# Altium schematic sheet power_SUP.SchDoc
size A4
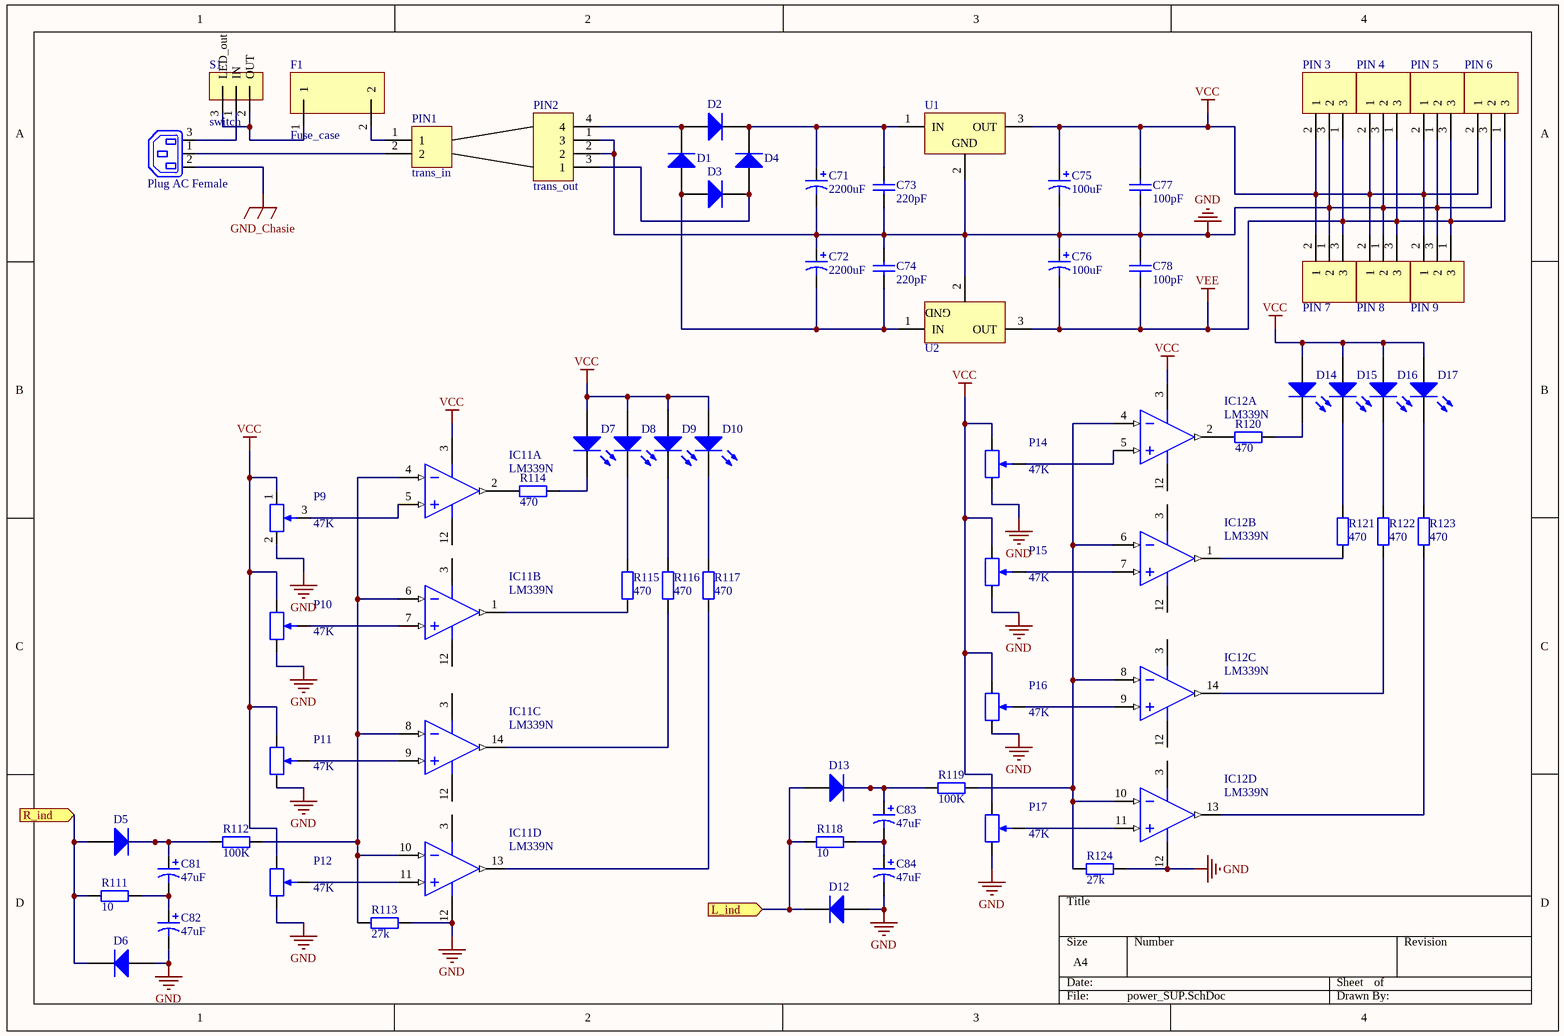
[diagram p0: power_SUP.SchDoc]

## Parts
?  Plug AC Female  [header_3]
C71  value 2200uF  [capacitor 2200uF]  (hidden comment: Cap Pol2)
C72  value 2200uF  [capacitor 2200uF]  (hidden comment: Cap Pol2)
C73  value 220pF  [220PpF]  (hidden comment: Cap)
C74  value 220pF  [220PpF]  (hidden comment: Cap)
C75  value 100uF  [Capacitor 100uF]  (hidden comment: Cap Pol2)
C76  value 100uF  [Capacitor 100uF]  (hidden comment: Cap Pol2)
C77  value 100pF  [Capacitor 100pF]  (hidden comment: Cap)
C78  value 100pF  [Capacitor 100pF]  (hidden comment: Cap)
C81  value 47uF  [Capacitor 47uF]  (hidden comment: Cap Pol2)
C82  value 47uF  [Capacitor 47uF]  (hidden comment: Cap Pol2)
C83  value 47uF  [Capacitor 47uF]  (hidden comment: Cap Pol2)
C84  value 47uF  [Capacitor 47uF]  (hidden comment: Cap Pol2)
D1  Diode 1N4007  [DO-41]  (value not drawn)
D2  Diode 1N4007  [DO-41]  (value not drawn)
D3  Diode 1N4007  [DO-41]  (value not drawn)
D4  Diode 1N4007  [DO-41]  (value not drawn)
D5  Diode 1N4007  [DO-41]  (value not drawn)
D6  Diode 1N4007  [DO-41]  (value not drawn)
D7  LED1  [LED]  (value not drawn)
D8  LED1  [LED]  (value not drawn)
D9  LED1  [LED]  (value not drawn)
D10  LED1  [LED]  (value not drawn)
D12  Diode 1N4007  [DO-41]  (value not drawn)
D13  Diode 1N4007  [DO-41]  (value not drawn)
D14  LED1  [LED]  (value not drawn)
D15  LED1  [LED]  (value not drawn)
D16  LED1  [LED]  (value not drawn)
D17  LED1  [LED]  (value not drawn)
F1  Fuse_case  [fluse_holder]
IC11  LM339N  [OPAMP_LM339]  (parts A,B,C,D of 4)
IC12  LM339N  [OPAMP_LM339]  (parts A,B,C,D of 4)
P9  value 47K  [trimmer]  (hidden comment: RPot)
P10  value 47K  [trimmer]  (hidden comment: RPot)
P11  value 47K  [trimmer]  (hidden comment: RPot)
P12  value 47K  [trimmer]  (hidden comment: RPot)
P14  value 47K  [trimmer]  (hidden comment: RPot)
P15  value 47K  [trimmer]  (hidden comment: RPot)
P16  value 47K  [trimmer]  (hidden comment: RPot)
P17  value 47K  [trimmer]  (hidden comment: RPot)
PIN1  trans_in  [header_2]
PIN2  trans_out  [transfo]
PIN_3  Header 3  [header_3]  (value not drawn)
PIN_4  Header 3  [header_3]  (value not drawn)
PIN_5  Header 3  [header_3]  (value not drawn)
PIN_6  Header 3  [header_3]  (value not drawn)
PIN_7  Header 3  [header_3]  (value not drawn)
PIN_8  Header 3  [header_3]  (value not drawn)
PIN_9  Header 3  [header_3]  (value not drawn)
R111  value 10  [C1206]  (hidden comment: Res2)
R112  value 100K  [C1206]  (hidden comment: Res2)
R113  value 27k  [C1206]  (hidden comment: Res2)
R114  value 470  [C1206]  (hidden comment: Res2)
R115  value 470  [C1206]  (hidden comment: Res2)
R116  value 470  [C1206]  (hidden comment: Res2)
R117  value 470  [C1206]  (hidden comment: Res2)
R118  value 10  [C1206]  (hidden comment: Res2)
R119  value 100K  [C1206]  (hidden comment: Res2)
R120  value 470  [C1206]  (hidden comment: Res2)
R121  value 470  [C1206]  (hidden comment: Res2)
R122  value 470  [C1206]  (hidden comment: Res2)
R123  value 470  [C1206]  (hidden comment: Res2)
R124  value 27k  [C1206]  (hidden comment: Res2)
S1  switch  [header_3]
U1  L7812ACV  [Volt_reg]  (value not drawn)
U2  L7912ACV  [Volt_reg]  (value not drawn)

## Ports
L_ind (in), R_ind (in)

## Nets
GND: C71.2 C72.1 C73.1 C74.2 C75.2 C76.1 C77.1 C78.2 C82.2 C84.2 D6.1(A) D12.1(A) IC11.12(GND) IC12.12(GND) P9.2(BOT) P10.2(BOT) P11.2(BOT) P12.2(BOT) P14.2(BOT) P15.2(BOT) P16.2(BOT) P17.2(BOT) PIN2.1(3) PIN2.2 PIN_3.3(2) PIN_4.3(2) PIN_5.1(2) PIN_6.3(2) PIN_7.1(2) PIN_8.1(2) PIN_9.3(2) R113.2 R124.2 U1.2(GND) U2.2(GND)
GND_Chasie: ?.2(N)
VCC: C75.1 C77.2 D7.1(A) D8.1(A) D9.1(A) D10.1(A) D14.1(A) D15.1(A) D16.1(A) D17.1(A) IC11.3(V+) IC12.3(V+) P9.1(TOP) P10.1(TOP) P11.1(TOP) P12.1(TOP) P14.1(TOP) P15.1(TOP) P16.1(TOP) P17.1(TOP) PIN_3.2(1) PIN_4.2(1) PIN_5.2(1) PIN_6.2(1) PIN_7.2(1) PIN_8.2(1) PIN_9.2(1) U1.3(OUT)
VEE: C76.2 C78.1 PIN_3.1(3) PIN_4.1(3) PIN_5.3 PIN_6.1(3) PIN_7.3 PIN_8.3 PIN_9.1(3) U2.3(OUT)
L_ind: D12.2(K) D13.1(A) R118.1 ; port L_ind
R_ind: D5.1(A) D6.2(K) R111.1 ; port R_ind
Net?_1: ?.1(E) PIN1.2
Net?_3: ?.3(L) S1.1(IN)
NetC71_1: C71.1 C73.2 D2.2(K) D4.2(K) U1.1(IN)
NetC72_2: C72.2 C74.1 D1.1(A) D3.1(A) U2.1(IN)
NetC81_1: C81.1 D5.2(K) R112.1
NetC81_2: C81.2 C82.1 R111.2
NetC83_1: C83.1 D13.2(K) R119.1
NetC83_2: C83.2 C84.1 R118.2
NetD1_2: D1.2(K) D2.1(A) PIN2.4
NetD3_2: D3.2(K) D4.1(A) PIN2.3(1)
NetD7_2: D7.2(K) R114.1
NetD8_2: D8.2(K) R115.2
NetD9_2: D9.2(K) R116.2
NetD10_2: D10.2(K) R117.2
NetD14_2: D14.2(K) R120.1
NetD15_2: D15.2(K) R121.2
NetD16_2: D16.2(K) R122.2
NetD17_2: D17.2(K) R123.2
NetF1_1: F1.1 S1.2(OUT) S1.3(LED_out)
NetF1_2: F1.2 PIN1.1
NetIC11_1: IC11.1(OUT2) R115.1
NetIC11_2: IC11.2(OUT1) R114.2
NetIC11_4: IC11.4(IN1-) IC11.6(IN2-) IC11.8(IN3-) IC11.10(IN4-) R112.2 R113.1
NetIC11_5: IC11.5(IN1+) P9.3(TAP)
NetIC11_7: IC11.7(IN2+) P10.3(TAP)
NetIC11_9: IC11.9(IN3+) P11.3(TAP)
NetIC11_11: IC11.11(IN4+) P12.3(TAP)
NetIC11_13: IC11.13(OUT4) R117.1
NetIC11_14: IC11.14(OUT3) R116.1
NetIC12_1: IC12.1(OUT2) R121.1
NetIC12_2: IC12.2(OUT1) R120.2
NetIC12_4: IC12.4(IN1-) IC12.6(IN2-) IC12.8(IN3-) IC12.10(IN4-) R119.2 R124.1
NetIC12_5: IC12.5(IN1+) P14.3(TAP)
NetIC12_7: IC12.7(IN2+) P15.3(TAP)
NetIC12_9: IC12.9(IN3+) P16.3(TAP)
NetIC12_11: IC12.11(IN4+) P17.3(TAP)
NetIC12_13: IC12.13(OUT4) R123.1
NetIC12_14: IC12.14(OUT3) R122.1

## Library data of the parts
? = Plug AC Female: IEC Mains Power Outlet, EN60 320-2-2 F Class I, PC Flange Rear Mount, Chassis Socket; PackageDocument: ver.80, 15-Sep-2003; MaximumRating: 10A, 250V a.c. (UL & CSA 15A, 250V a.c.); MountingFixtures: Not drawn on schematic symbol.; PCB_Layout: Complies with manufacturer's recommendation.; DrillSize: Corresponds to nominal value.; Published: 15-Jul-2004; LatestRevisionDate: 15-Jul-2004; LatestRevisionNote: Component Replaced & renamed from "Phonejack".; DatasheetDocument: ver.80, 15-Sep-2003; PackageReference: PX0675/PC; Publisher: Altium Limited; Terminations: P.C. Spills; ComponentLink1Description: Manufacturer Link; ComponentLink1URL: http://www.bulgin.co.uk/
C71 C72 C81-C84 = Cap Pol2: electrolytic; Published: 8-Jun-2000; LatestRevisionDate: 17-Jul-2002; LatestRevisionNote: Re-released for DXP Platform.; PackageReference: POLAR0.8; Publisher: Altium Limited; PackageDescription: Polarized Capacitor; 2 Leads
C73 C74 C77 C78 = Cap_3: Capacitor; Published: 8-Jun-2000; LatestRevisionDate: 17-Jul-2002; LatestRevisionNote: Re-released for DXP Platform.; PackageReference: RAD-0.3; Publisher: Altium Limited; PackageDescription: Radial Cap, Thru-Hole; 2 Leads; 0.3 in Pin Spacing
C75 C76 = Cap Pol2_2: Polarized Capacitor (Axial); Published: 8-Jun-2000; LatestRevisionDate: 17-Jul-2002; LatestRevisionNote: Re-released for DXP Platform.; PackageReference: POLAR0.8; Publisher: Altium Limited; PackageDescription: Polarized Capacitor; 2 Leads
D1-D6 D12 D13 = Diode 1N4007: 1 Amp General Purpose Rectifier; Published: 8-Jun-2000; LatestRevisionDate: 17-Jul-2002; LatestRevisionNote: Re-released for DXP Platform.; DatasheetVersion: 1998; PackageVersion: Aug-1999; PackageReference: DO-41; Publisher: Altium Limited; PackageDescription: Diode, Axial; Body 5.2 x 2.7 mm (LxDia. max), Lead Dia. 0.86 mm (max); Code_JEDEC: DO-204-AL; ComponentLink1Description: Manufacturer Link; ComponentLink1URL: http://www.fairchildsemi.com/; ComponentLink2Description: Datasheet; ComponentLink2URL: http://www.fairchildsemi.com/ds/1N%2F1N4001.pdf
D7-D10 D14-D17 = LED1: Typical RED GaAs LED; Published: 8-Jun-2000; LatestRevisionDate: 08-Jul-2005; LatestRevisionNote: Mech Layer 1 removed.; PackageReference: LED-1; Publisher: Altium Limited; PackageDescription: LED; 2 Leads
IC11 IC12 = opamp_LM339: Low Power Low Offset Voltage Quad Comparator, 14-pin MDIP; Manufacturer: Texas Instruments; CompType: Amplifiers; PackageTopMarking: NSUZXYYTTE#*LM339N; PowerWise: N; Code_JEDEC: MS-001-AA; ComponentLink1URL: http://www.ti.com/general/docs/lit/getliterature.tsp?genericPartNumber=LM339&fileType=pdf; Package Reference: N0014A; ComponentLink1Description: Datasheet URL; RoHS: N; PinCount: 14; PackageDescription: MDIP, .750 x .250 x.130in, 14 Lead, .100in Pitch
P9-P12 P14-P17 = RPot_1: Potentiometer; Sim Note: Enter the Resistance value and the set point into parameter fields.; Set Position: 0.5; Published: 8-Jun-2000; LatestRevisionDate: 17-Jul-2002; LatestRevisionNote: Re-released for DXP Platform.; PackageReference: VR5; Publisher: Altium Limited; PackageDescription: Variable Resistor, Thru-Hole; 3 Leads
PIN1 = MHDR1X2: Header, 2-Pin; LatestRevisionDate: 17-Jul-2002; LatestRevisionNote: Re-released for DXP Platform.; Publisher: Altium Limited
PIN2 = MHDR1X4: Header, 4-Pin; LatestRevisionDate: 17-Jul-2002; LatestRevisionNote: Re-released for DXP Platform.; Publisher: Altium Limited
PIN_3-PIN_9 = Header 3: Header, 3-Pin; LatestRevisionDate: 17-Jul-2002; LatestRevisionNote: Re-released for DXP Platform.; Publisher: Altium Limited
R111 R118 = Res2_2: Resistor; Published: 8-Jun-2000; LatestRevisionDate: 17-Jul-2002; LatestRevisionNote: Re-released for DXP Platform.; PackageReference: AXIAL-0.4; Publisher: Altium Limited; PackageDescription: Axial Device, Thru-Hole; 2 Leads; 0.4 in Pin Spacing
R112 R119 = Res2_5: Resistor; Published: 8-Jun-2000; LatestRevisionDate: 17-Jul-2002; LatestRevisionNote: Re-released for DXP Platform.; PackageReference: AXIAL-0.4; Publisher: Altium Limited; PackageDescription: Axial Device, Thru-Hole; 2 Leads; 0.4 in Pin Spacing
R113 R124 = Res2: Resistor; Published: 8-Jun-2000; LatestRevisionDate: 17-Jul-2002; LatestRevisionNote: Re-released for DXP Platform.; PackageReference: AXIAL-0.4; Publisher: Altium Limited; PackageDescription: Axial Device, Thru-Hole; 2 Leads; 0.4 in Pin Spacing
R114-R117 R120-R123 = Res2_13: Resistor; Published: 8-Jun-2000; LatestRevisionDate: 17-Jul-2002; LatestRevisionNote: Re-released for DXP Platform.; PackageReference: AXIAL-0.4; Publisher: Altium Limited; PackageDescription: Axial Device, Thru-Hole; 2 Leads; 0.4 in Pin Spacing
U1 = 7812: Positive Voltage Regulator, 12V, 3-Pin TO-220; PackageDescription: TO, Thru-Hole, Vertical, Heatsink Mounted; 3 In-Line Leads; Pitch 2.54 mm; ComponentLink3URL: http://www.st.com/internet/com/TECHNICAL_RESOURCES/TECHNICAL_LITERATURE/PACKAGE_INFORMATION/CD00004649.pdf; ComponentLink3Description: Package Specification; DatasheetVersion: 16/11/2011; ComponentLink1Description: Manufacturer URL; PackageVersion: ver3.0; PackageReference: TO220; ComponentLink1URL: http://www.st.com; ComponentLink2Description: Datasheet; ComponentLink2URL: http://www.st.com/internet/com/TECHNICAL_RESOURCES/TECHNICAL_LITERATURE/DATASHEET/CD00000444.pdf
U2 = 7912: 2% Negative Voltage Regulator, -12V, 3-Pin TO-220; ComponentLink2Description: Datasheet; PackageReference: TO220; ComponentLink1Description: Manufacturer URL; DatasheetVersion: 1/11/2010; ComponentLink2URL: http://www.st.com/internet/com/TECHNICAL_RESOURCES/TECHNICAL_LITERATURE/DATASHEET/CD00000451.pdf; PackageVersion: ver3.0; ComponentLink3Description: Package Specification; PackageDescription: TO, Thru-Hole, Vertical, Heatsink Mounted; 3 In-Line Leads; Pitch 2.54 mm; ComponentLink3URL: http://www.st.com/internet/com/TECHNICAL_RESOURCES/TECHNICAL_LITERATURE/PACKAGE_INFORMATION/CD00004649.pdf; ComponentLink1URL: http://www.st.com